# Altium schematic sheet XMOS_TSBOARD_DAC.SchDoc
size A4; DocumentNumber: 7; SheetNumber: 7; SheetTotal: 8
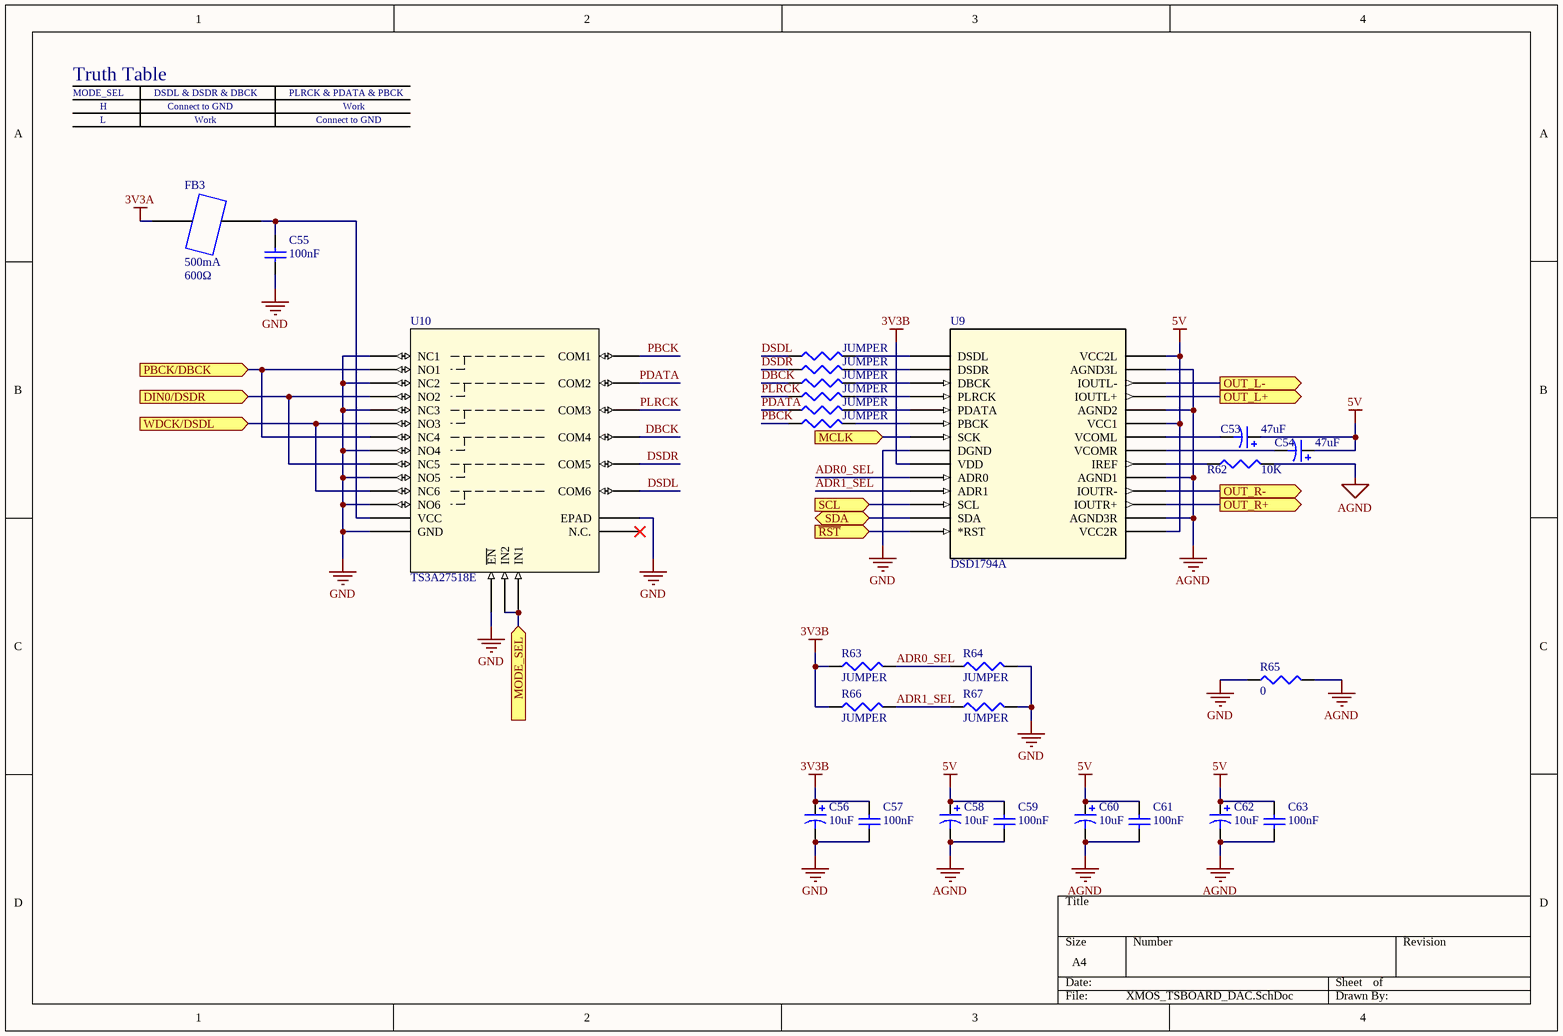
[diagram p0: XMOS_TSBOARD_DAC.SchDoc]

## Parts
C53  value 47uF  [C0805]  (hidden comment: Cap Pol3)
C54  value 47uF  [C0805]  (hidden comment: Cap Pol3)
C55  value 100nF  [1608[0603]]  (hidden comment: Cap Semi)
C56  value 10uF  [C0805]  (hidden comment: Cap Pol3)
C57  value 100nF  [1608[0603]]  (hidden comment: Cap Semi)
C58  value 10uF  [C0805]  (hidden comment: Cap Pol3)
C59  value 100nF  [1608[0603]]  (hidden comment: Cap Semi)
C60  value 10uF  [C0805]  (hidden comment: Cap Pol3)
C61  value 100nF  [1608[0603]]  (hidden comment: Cap Semi)
C62  value 10uF  [C0805]  (hidden comment: Cap Pol3)
C63  value 100nF  [1608[0603]]  (hidden comment: Cap Semi)
FB3  RatedCurrent: 500mA  Impedance(100MHz): 600Ω  [0603]  (hidden comment: FerriteBeads)
R56  JUMPER  [J1-0603]
R57  JUMPER  [J1-0603]
R58  JUMPER  [J1-0603]
R59  JUMPER  [J1-0603]
R60  JUMPER  [J1-0603]
R61  JUMPER  [J1-0603]
R62  value 10K  [J1-0603]  (hidden comment: Res3)
R63  JUMPER  [J1-0603]
R64  JUMPER  [J1-0603]
R65  value 0  [J1-0603]  (hidden comment: Res3)
R66  JUMPER  [J1-0603]
R67  JUMPER  [J1-0603]
U9  DSD1794A  [DB28]
U10  TS3A27518E  [RTW24]

## Ports
DIN0/DSDR (in), MCLK (in), MODE_SEL (in), OUT_L+ (out), OUT_L- (out), OUT_R+ (out), OUT_R- (out), PBCK/DBCK (in), SCL (in), SDA (bidir), WDCK/DSDL (in), ~{RST} (in)

## Nets
3V3A: FB3.1
3V3B: C56.1 C57.2 R63.1 R66.1 U9.9(VDD)
5V: C53.1 C54.1 C58.1 C59.2 C60.1 C61.2 C62.1 C63.2 U9.15(VCC2R) U9.23(VCC1) U9.28(VCC2L)
AGND: C58.2 C59.1 C60.2 C61.1 C62.2 C63.1 R62.2 R65.2 U9.16(AGND3R) U9.19(AGND1) U9.24(AGND2) U9.27(AGND3L)
GND: C55.1 C56.2 C57.1 R64.2 R65.1 R67.2 U9.8(DGND) U10.2(GND) U10.13(NO6) U10.14(NO4) U10.15(NO5) U10.17(~{EN}) U10.20(NC3) U10.22(NC2) U10.23(NC1) U10.25(EPAD)
ADR0_SEL: R63.2 R64.1 U9.10(ADR0)
ADR1_SEL: R66.2 R67.1 U9.11(ADR1)
DBCK: R58.1 U10.6(COM4)
DIN0/DSDR: U10.10(NO2) U10.16(NC5) ; port DIN0/DSDR
DSDL: R56.1 U10.9(COM6)
DSDR: R57.1 U10.7(COM5)
MCLK: U9.7(SCK) ; port MCLK
MODE_SEL: U10.11(IN2) U10.21(IN1) ; port MODE_SEL
OUT_L+: U9.25(IOUTL+) ; port OUT_L+
OUT_L-: U9.26(IOUTL-) ; port OUT_L-
OUT_R+: U9.17(IOUTR+) ; port OUT_R+
OUT_R-: U9.18(IOUTR-) ; port OUT_R-
PBCK: R61.1 U10.1(COM1)
PBCK/DBCK: U10.8(NO1) U10.18(NC4) ; port PBCK/DBCK
PDATA: R60.1 U10.3(COM2)
PLRCK: R59.1 U10.4(COM3)
~{RST}: U9.14(*RST) ; port ~{RST}
SCL: U9.12(SCL) ; port SCL
SDA: U9.13(SDA) ; port SDA
WDCK/DSDL: U10.12(NO3) U10.19(NC6) ; port WDCK/DSDL
NetC53_2: C53.2 U9.22(VCOML)
NetC54_2: C54.2 U9.21(VCOMR)
NetC55_2: C55.2 FB3.2 U10.5(VCC)
NetR56_2: R56.2 U9.1(DSDL)
NetR57_2: R57.2 U9.2(DSDR)
NetR58_2: R58.2 U9.3(DBCK)
NetR59_2: R59.2 U9.4(PLRCK)
NetR60_2: R60.2 U9.5(PDATA)
NetR61_2: R61.2 U9.6(PBCK)
NetR62_1: R62.1 U9.20(IREF)

Not connected (* = marked no-connect by the designer): U10 24(N.C.)*

## Notes on the sheet
- Truth Table
- MODE_SEL
- H
- DSDL & DSDR & DBCK
- Connect to GND
- PLRCK & PDATA & PBCK
- Work
- L

## Library data of the parts
C53 C54 C56 C58 C60 C62 = Cap Pol3: Polarized Capacitor (Surface Mount); Published: 8-Jun-2000; LatestRevisionDate: 29-May-2009; LatestRevisionNote: IPC-7351 Footprint Added.; PackageReference: C0805; Publisher: Altium Limited; PackageDescription: Chip Capacitor
C55 C57 C59 C61 C63 = Cap Semi: Capacitor (Semiconductor SIM Model); Published: 8-Jun-2000; LatestRevisionDate: 29-May-2009; LatestRevisionNote: IPC-7351 Footprint Added.; PackageReference: C1206; Publisher: Altium Limited; PackageDescription: Chip Capacitor
FB3 = FerriteBeads: Chip Ferrite Beads; DCResistance: 0.35Ω; ManID: BLM18EG601
R56-R61 R63 R64 R66 R67 = Res3: Resistor; Value: 0; Published: 8-Jun-2000; LatestRevisionDate: 29-May-2009; LatestRevisionNote: IPC-7351 Footprint Added.; PackageReference: J1-0603; Publisher: Altium Limited; PackageDescription: Chip Resistor
R62 R65 = Res3: Resistor; Published: 8-Jun-2000; LatestRevisionDate: 29-May-2009; LatestRevisionNote: IPC-7351 Footprint Added.; PackageReference: J1-0603; Publisher: Altium Limited; PackageDescription: Chip Resistor
U9 = DSD1794A: 24-Bit 192-kHz Sampling Advanced Segment Audio Stereo DAC
U10 = TS3A27518E: 6-Channel, 1:2 Multiplexer/Demultiplexer